# EAGLE schematic ardiuno shield (EAGLE 6.4)
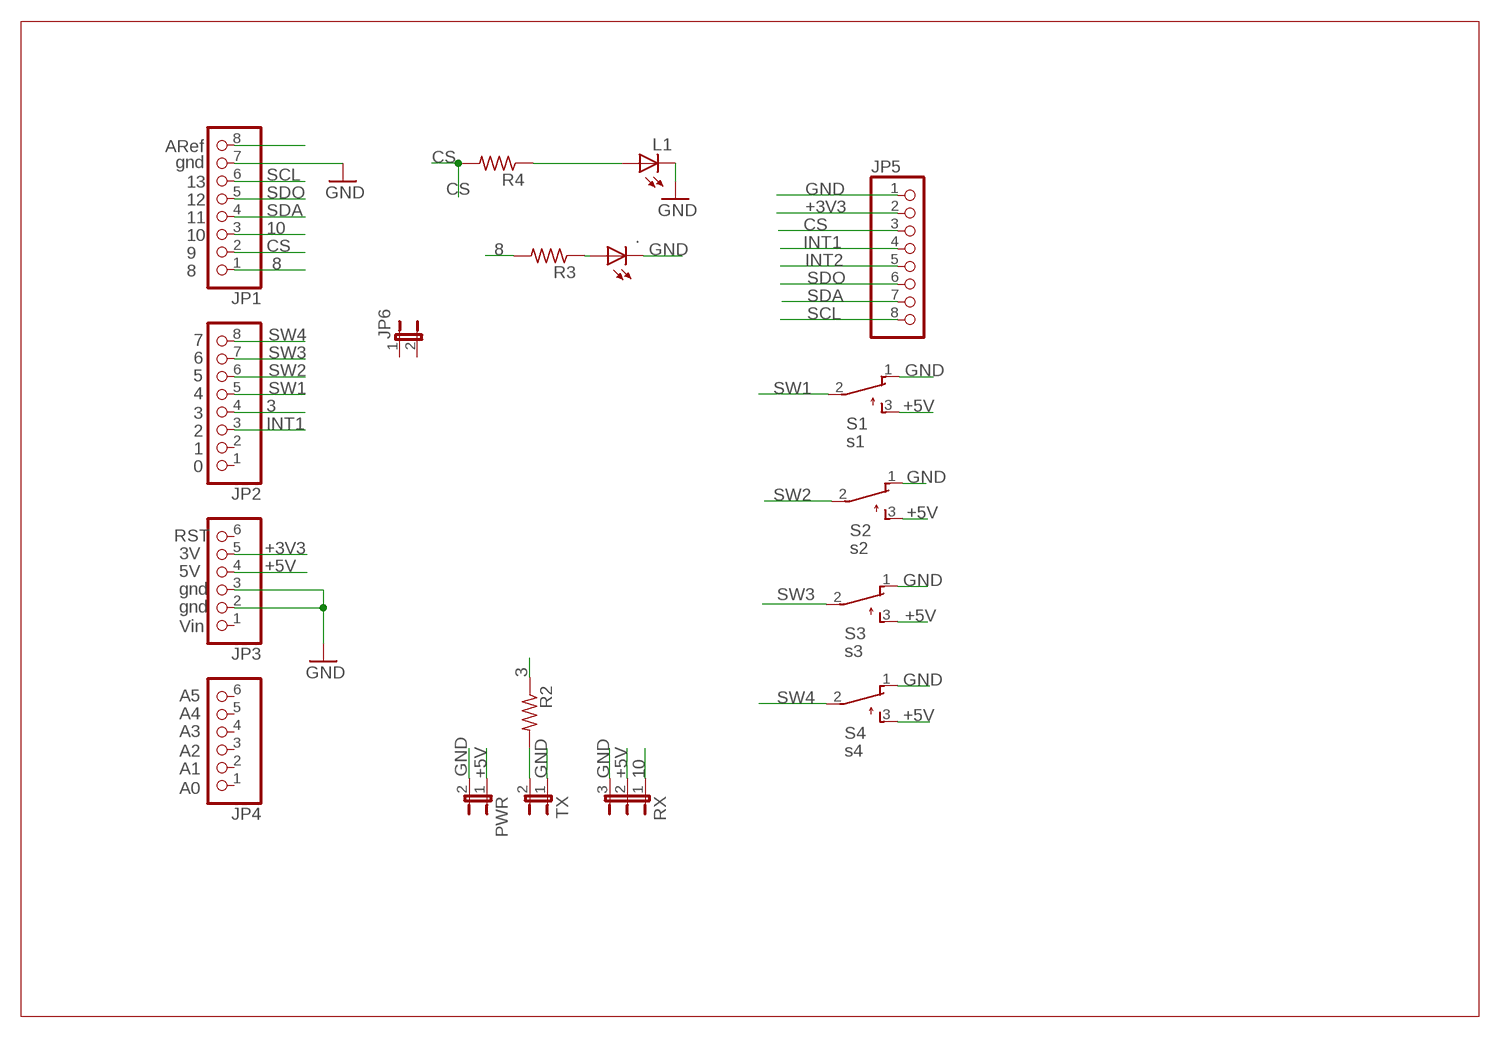
[diagram p0: schematic, sheet 1]

## Parts
.  LED5MM  [LED5MM]
JP1  PINHD-1X8  [1X08]
JP2  PINHD-1X8  [1X08]
JP3  PINHD-1X6  [1X06]
JP4  PINHD-1X6  [1X06]
JP5  PINHD-1X8  [1X08]
JP6  JP1E  [JP1]
L1  LED5MM  [LED5MM]
PWR  JP1E  [JP1]
R2  R-US_0207/10  [0207/10]
R3  R-US_0207/10  [0207/10]
R4  R-US_0207/10  [0207/10]
RX  JP2E  [JP2]
S1  s1  TL32PO  [TL3XPO]
S2  s2  TL32PO  [TL3XPO]
S3  s3  TL32PO  [TL3XPO]
S4  s4  TL32PO  [TL3XPO]
TX  JP1E  [JP1]

## Nets
3: JP2.4 R2.1
8: JP1.1 R3.2
10: JP1.3 RX.1
+3V3: JP3.5 JP5.2
+5V: JP3.4 PWR.1 RX.2 S1.3(S) S2.3(S) S3.3(S) S4.3(S)
CS: JP1.2 JP5.3 R4.2
GND: ..K(C) JP1.7 JP3.2 JP3.3 JP5.1 L1.K(C) PWR.2 RX.3 S1.1(O) S2.1(O) S3.1(O) S4.1(O) TX.1
INT1: JP2.3 JP5.4
INT2: JP5.5
N$1: L1.A R4.1
N$2: ..A R3.1
N$5: JP1.8
N$13: R2.2 TX.2
SCL: JP1.6 JP5.8
SDA: JP1.4 JP5.7
SDO: JP1.5 JP5.6
SW1: JP2.5 S1.2(P)
SW2: JP2.6 S2.2(P)
SW3: JP2.7 S3.2(P)
SW4: JP2.8 S4.2(P)
Unconnected: JP2.1 JP2.2 JP3.1 JP3.6 JP4.1 JP4.2 JP4.3 JP4.4 JP4.5 JP4.6 JP6.1 JP6.2

## Notes on the sheet
- ARef
- gnd
- 13
- 12
- 11
- 10
- 9
- 8
- 7
- 6
- 5
- 4
- 3
- 2
- 1
- 0
- RST
- 3V
- 5V
- gnd
- gnd
- Vin
- A5
- A4
- A3
- A2
- A1
- A0

## Library data of the parts
. L1 = led:LED: LED OSRAM: - CHIPLED LG R971, LG N971, LY N971, LG Q971, LY Q971, LO R971, LY R971 LH N974, LH R974 LS Q976, LO Q976, LY Q976 LO Q996 - Hyper CHIPLED LW Q18S LB Q993, LB Q99A, LB R99A - SideLED LS A670, LO A670, LY A670, LG A670, LP A670 LB A673, LV A673, LT A673, LW A673 LH A674 LY A675 LS A676, LA A676, LO A676, LY A676, LW A676 LS A679, LY A679, LG A679 - Hyper Micro SIDELED® LS Y876, LA Y876, LO Y876, LY Y876 LT Y87S - SmartLED LW L88C, LW L88S LB L89C, LB L89S, LG L890 LS L89K, LO L89K, LY L89K LS L896, LA L896, LO L896, LY L896 - TOPLED LS T670, LO T670, LY T670, LG T670, LP T670 LSG T670, LSP T670, LSY T670, LOP T670, LYG T670 LG T671, LOG T671, LSG T671 LB T673, LV T673, LT T673, LW T673 LH T674 LS T676, LA T676, LO T676, LY T676, LB T676, LH T676, LSB T676, LW T676 LB T67C, LV T67C, LT T67C, LS T67K, LO T67K, LY T67K, LW E67C LS E67B, LA E67B, LO E67B, LY E67B, LB E67C, LV E67C, LT E67C LW T67C LS T679, LY T679, LG T679 LS T770, LO T770, LY T770, LG T770, LP T770 LB T773, LV T773, LT T773, LW T773 LH T774 LS E675, LA E675, LY E675, LS T675 LS T776, LA T776, LO T776, LY T776, LB T776 LHGB T686 LT T68C, LB T68C - Hyper Mini TOPLED® LB M676 - Mini TOPLED Santana® LG M470 LS M47K, LO M47K, LY M47K Source: http://www.osram.convergy.de LUXEON: - LUMILED® LXK2-PW12-R00, LXK2-PW12-S00, LXK2-PW14-U00, LXK2-PW14-V00 LXK2-PM12-R00, LXK2-PM12-S00, LXK2-PM14-U00 LXK2-PE12-Q00, LXK2-PE12-R00, LXK2-PE12-S00, LXK2-PE14-T00, LXK2-PE14-U00 LXK2-PB12-K00, LXK2-PB12-L00, LXK2-PB12-M00, LXK2-PB14-N00, LXK2-PB14-P00, LXK2-PB14-Q00 LXK2-PR12-L00, LXK2-PR12-M00, LXK2-PR14-Q00, LXK2-PR14-R00 LXK2-PD12-Q00, LXK2-PD12-R00, LXK2-PD12-S00 LXK2-PH12-R00, LXK2-PH12-S00 LXK2-PL12-P00, LXK2-PL12-Q00, LXK2-PL12-R00 Source: www.luxeon.com KINGBRIGHT: KA-3528ASYC Source: www.kingbright.com
JP1 JP2 JP5 = pinhead:PINHD-1X8: PIN HEADER
JP3 JP4 = pinhead:PINHD-1X6: PIN HEADER
JP6 PWR TX = jumper:JP1E: JUMPER
R2-R4 = rcl:R-US_: RESISTOR, American symbol
RX = jumper:JP2E: JUMPER
S1-S4 = switch:TL32PO: TINY SWITCH ON - MOM Source: http://www2.produktinfo.conrad.com/datenblaetter/700000-724999/705152-da-01-de-Subminiaturschalter_TL_36YO.pdf